# Altium schematic sheet MCU.SchDoc
size A4
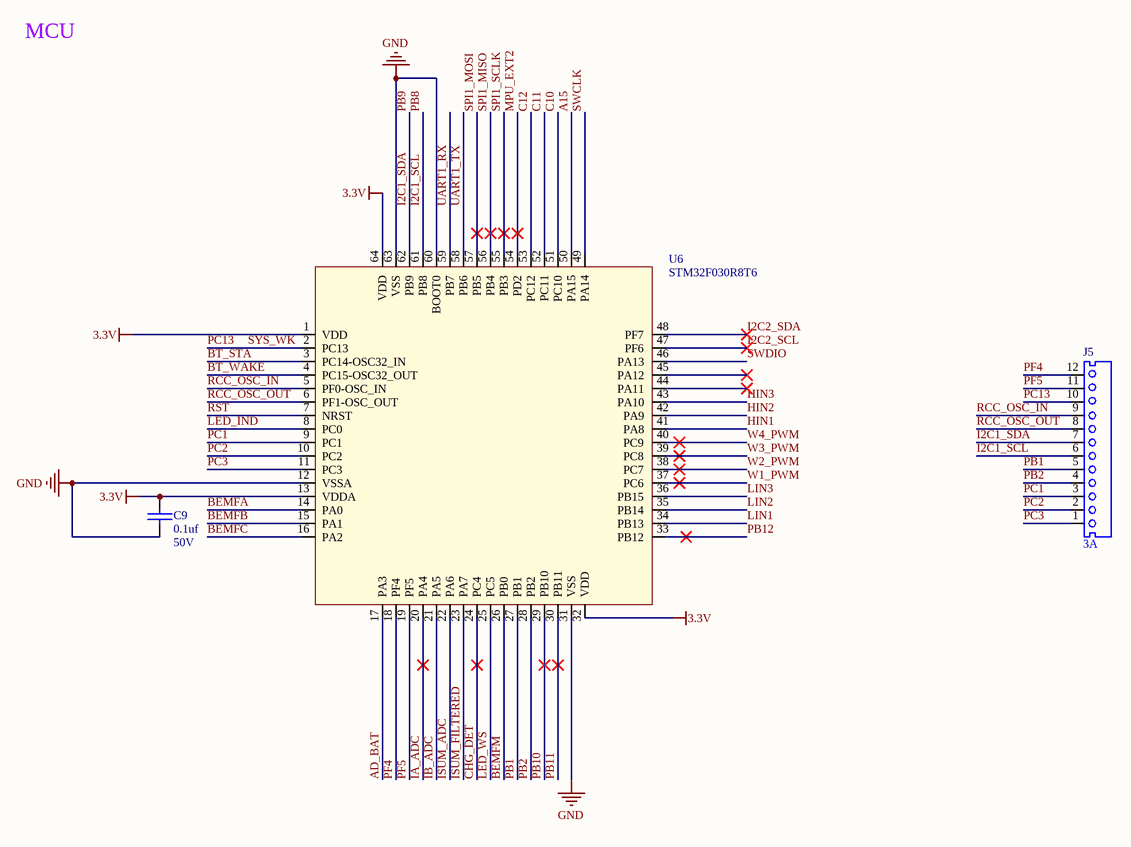
[diagram p0: MCU.SchDoc]

## Parts
C9  value 0.1uf  Voltage: 50V  [CAPC0603-RW]  (hidden comment: PXL456470-1530)
J5  Current: 3A  [CONN 12P PH=2.5 ST HAA250A-12A]  (hidden comment: T690300029300)
U6  MFG Part: STM32F030R8T6  [QFP50P1200X1200X160-64N]  (hidden comment: T610300097225)

## Nets
3.3V: C9.2 U6.1(VDD) U6.13(VDDA) U6.32(VDD) U6.64(VDD)
GND: C9.1 U6.12(VSSA) U6.31(VSS) U6.60(BOOT0) U6.63(VSS)
A15: U6.50(PA15)
AD_BAT: U6.17(PA3)
BEMFA: U6.14(PA0)
BEMFB: U6.15(PA1)
BEMFC: U6.16(PA2)
BEMFM: U6.26(PB0)
BT_STA: U6.3(PC14-OSC32_IN)
BT_WAKE: U6.4(PC15-OSC32_OUT)
C10: U6.51(PC10)
C11: U6.52(PC11)
C12: U6.53(PC12)
CHG_DET: U6.24(PC4)
HIN1: U6.41(PA8)
HIN2: U6.42(PA9)
HIN3: U6.43(PA10)
I2C1_SCL: J5.6 U6.61(PB8)  [also labelled PB8]
I2C1_SDA: J5.7 U6.62(PB9)  [also labelled PB9]
I2C2_SCL: U6.47(PF6)
I2C2_SDA: U6.48(PF7)
IA_ADC: U6.20(PA4)
IB_ADC: U6.21(PA5)
ISUM_ADC: U6.22(PA6)
ISUM_FILTERED: U6.23(PA7)
LED_IND: U6.8(PC0)
LED_WS: U6.25(PC5)
LIN1: U6.34(PB13)
LIN2: U6.35(PB14)
LIN3: U6.36(PB15)
MPU_EXT2: U6.54(PD2)
PB1: J5.5 U6.27(PB1)
PB2: J5.4 U6.28(PB2)
PB10: U6.29(PB10)
PB11: U6.30(PB11)
PB12: U6.33(PB12)
PC1: J5.3 U6.9(PC1)
PC2: J5.2 U6.10(PC2)
PC3: J5.1 U6.11(PC3)
PC13: J5.10 U6.2(PC13)  [also labelled SYS_WK]
PF4: J5.12 U6.18(PF4)
PF5: J5.11 U6.19(PF5)
RCC_OSC_IN: J5.9 U6.5(PF0-OSC_IN)
RCC_OSC_OUT: J5.8 U6.6(PF1-OSC_OUT)
RST: U6.7(NRST)
SPI1_MISO: U6.56(PB4)
SPI1_MOSI: U6.57(PB5)
SPI1_SCLK: U6.55(PB3)
SWCLK: U6.49(PA14)
SWDIO: U6.46(PA13)
UART1_RX: U6.59(PB7)
UART1_TX: U6.58(PB6)
W1_PWM: U6.37(PC6)
W2_PWM: U6.38(PC7)
W3_PWM: U6.39(PC8)
W4_PWM: U6.40(PC9)

Not connected (* = marked no-connect by the designer): U6 44(PA11)* 45(PA12)*

## Notes on the sheet
- MCU
- Title
- Size:
- Date:
- A4
- Number:
- Time:
- Revision:
- Sheet
- of
- Radio Flyer inc
- West Chicago
- File:

## Library data of the parts
C9 = CAP0603 0.015uF 50V 10%: GP CHIP CAP 0.015uF 50V 10% 0603 TYPE X7R; SAP: T542021537508; Vendor Code: 10010262; Vendor Name: 东莞市晴远电子有限公司; Type: Capacitor; DIP&SMD: SMD; PACKAGE: CAPC0603; MFG: *; MFG Part: *; Other: X7R; Tolerance: 10%; Customer Specific: N/A
J5 = CONN 12P PH=2.5 ST HAA250A-12A: CONNECTOR 12 PIN P:2.5MM P2.54-12 K; Value: 2.5mm; MFG: 金科基; CREATE_NAME: Nathan; DIP&SMD: DIP; SAP: T690300029300; MFG Part: HAA250A-12A; Vendor Name: *; Vendor Code: *; Type: Connector; CREATE_TIME: 10-Aug-2017
U6 = STM32F030RCT6TR: MCU STM32F030RCT6TR LQFP64 ST K; MFG: ST     (STM意法半導體); CREATE_NAME: Nathan; DIP&SMD: SMD; SAP: T610300097225; Type: IC; CREATE_TIME: 02-NOV-2017; Customer Specific: N/A